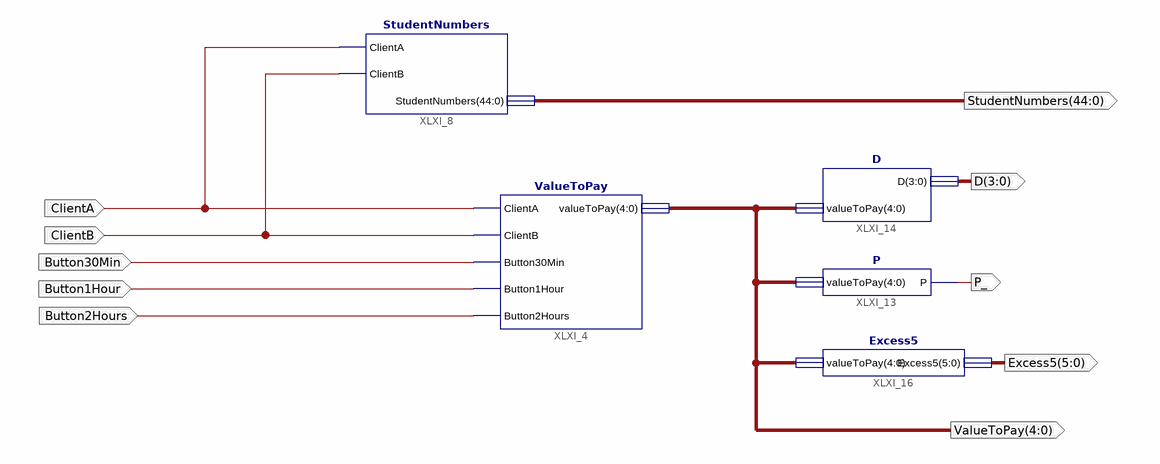
[diagram p0: schematic sheet 1]
// Xilinx ISE schematic FinalSchematic.sch (artix7) as structural Verilog: 5 symbols, 10 ports
module FinalSchematic (
  input  ClientA,
  input  Button2Hours,
  input  Button30Min,
  input  Button1Hour,
  input  ClientB,
  output [44:0] StudentNumbers,
  output [3:0] D,
  output [4:0] ValueToPay,
  output P_,
  output [5:0] Excess5
);

  ValueToPay XLXI_4 (
    .ClientA(ClientA), .ClientB(ClientB), .Button30Min(Button30Min), .Button1Hour(Button1Hour),
    .Button2Hours(Button2Hours), .valueToPay(ValueToPay));
  StudentNumbers XLXI_8 (.ClientA(ClientA), .ClientB(ClientB), .StudentNumbers(StudentNumbers));
  P XLXI_13 (.valueToPay(ValueToPay), .P(P_));
  D XLXI_14 (.valueToPay(ValueToPay), .D(D));
  Excess5 XLXI_16 (.valueToPay(ValueToPay), .Excess5(Excess5));
endmodule
